# EAGLE schematic RaspFPGA (EAGLE 6.1)

## Sheet 1 of 3: FPGA
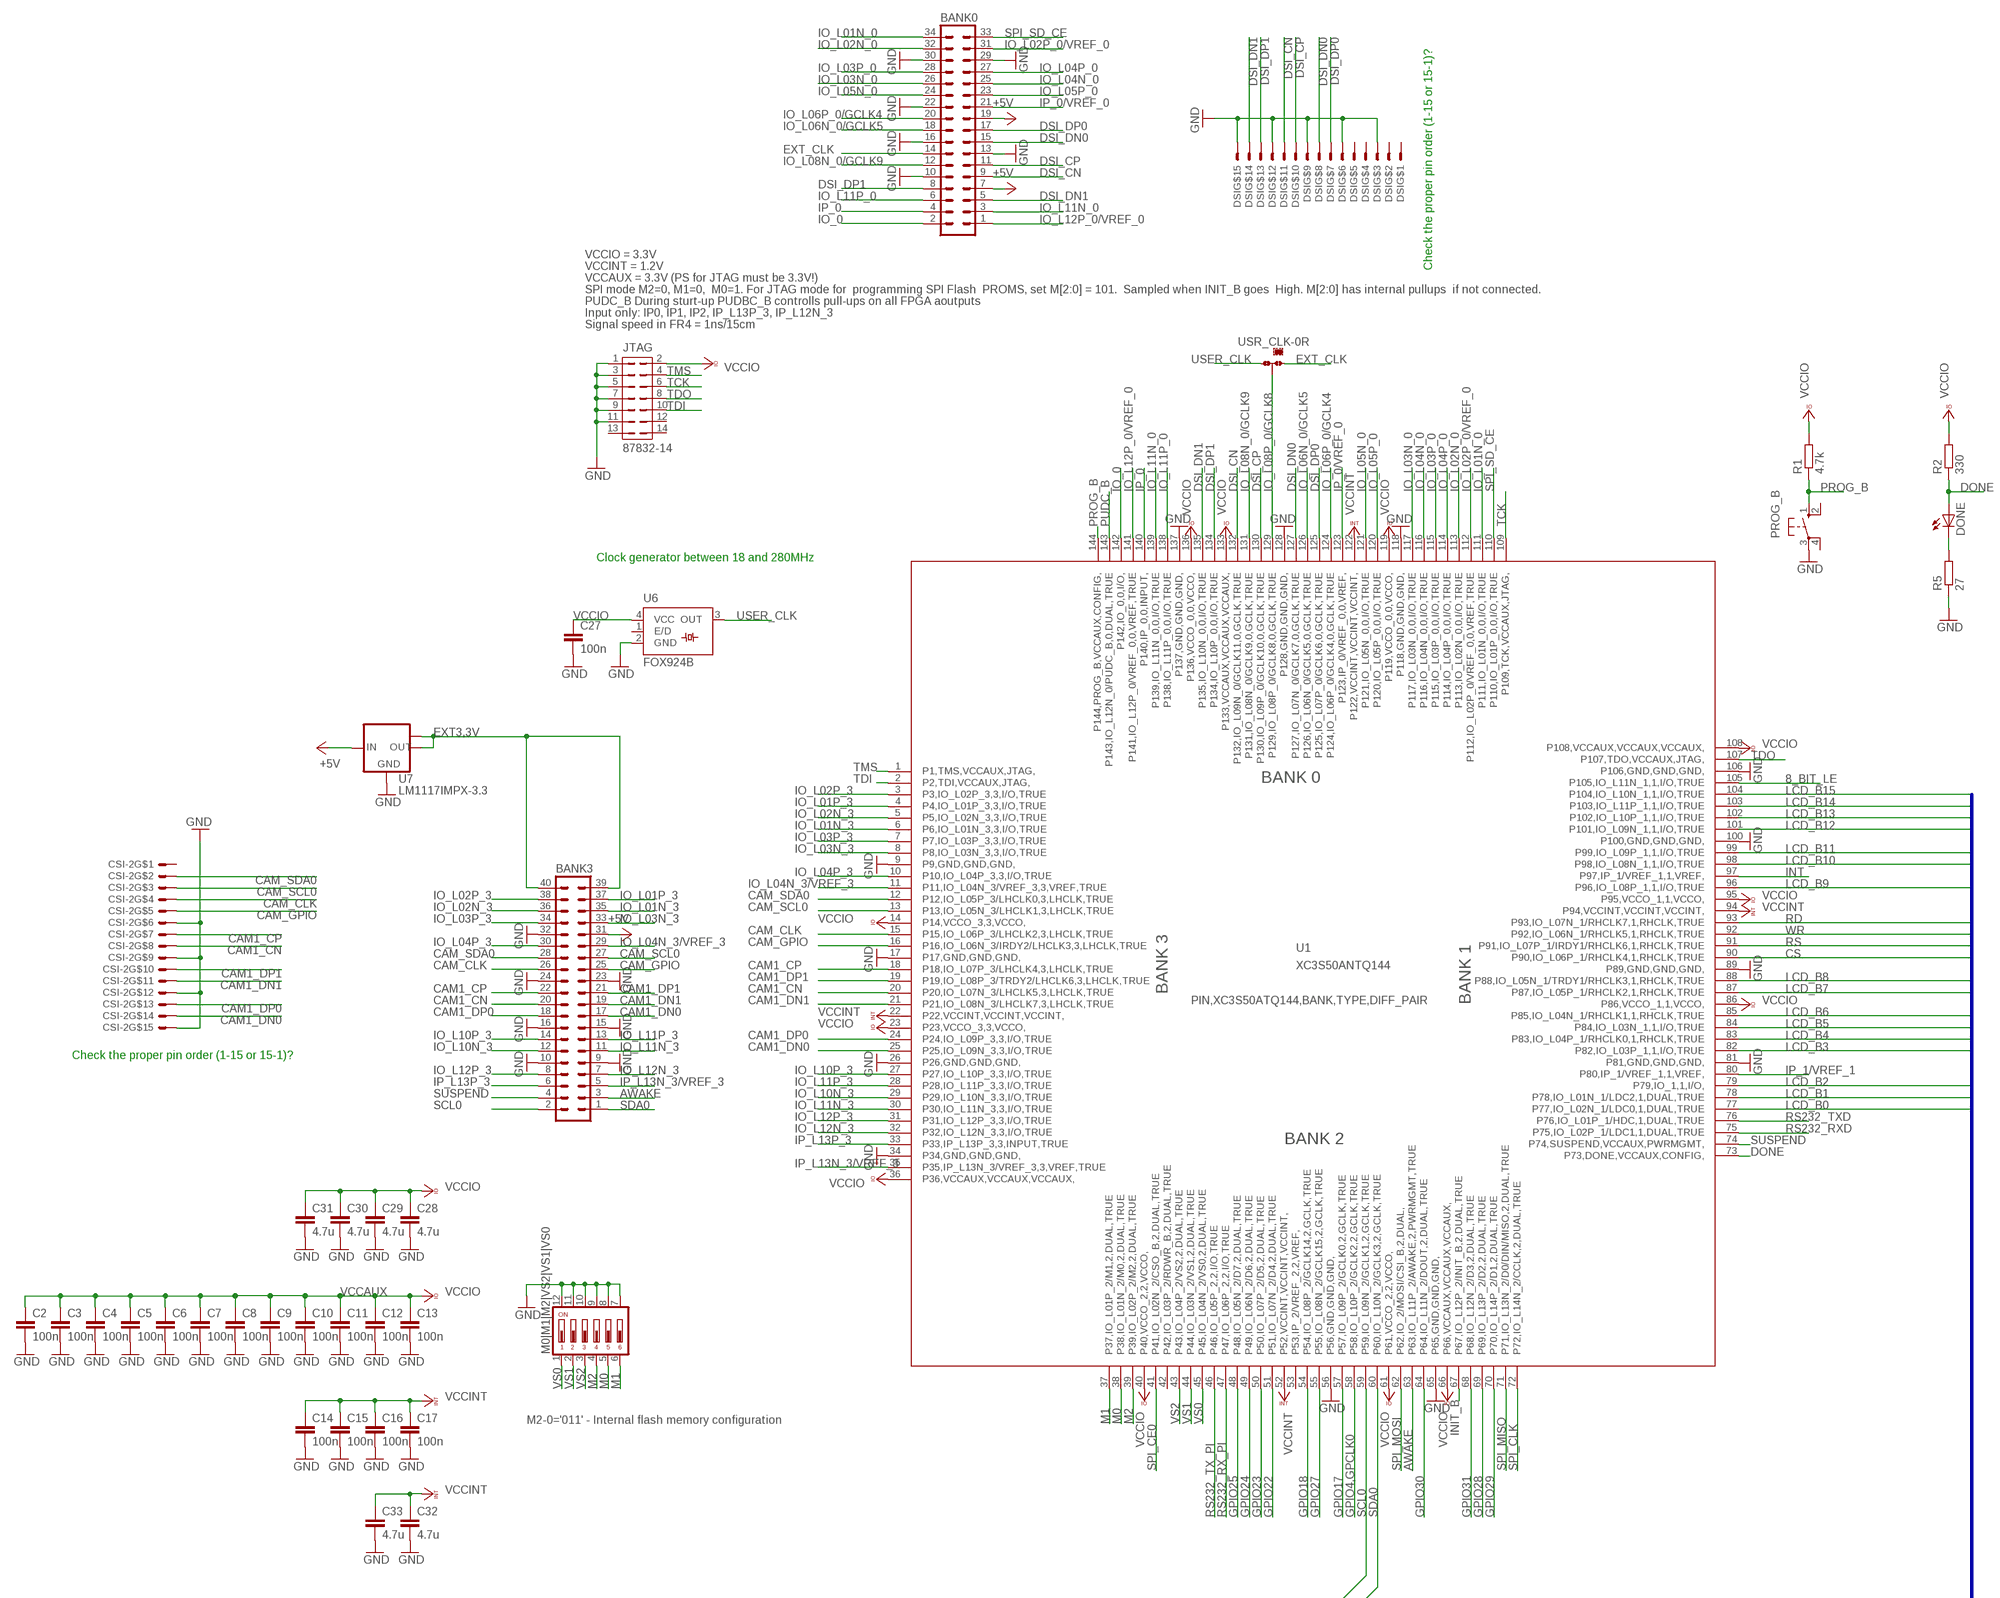
[diagram p0: schematic, sheet 1, part 1 of 3]
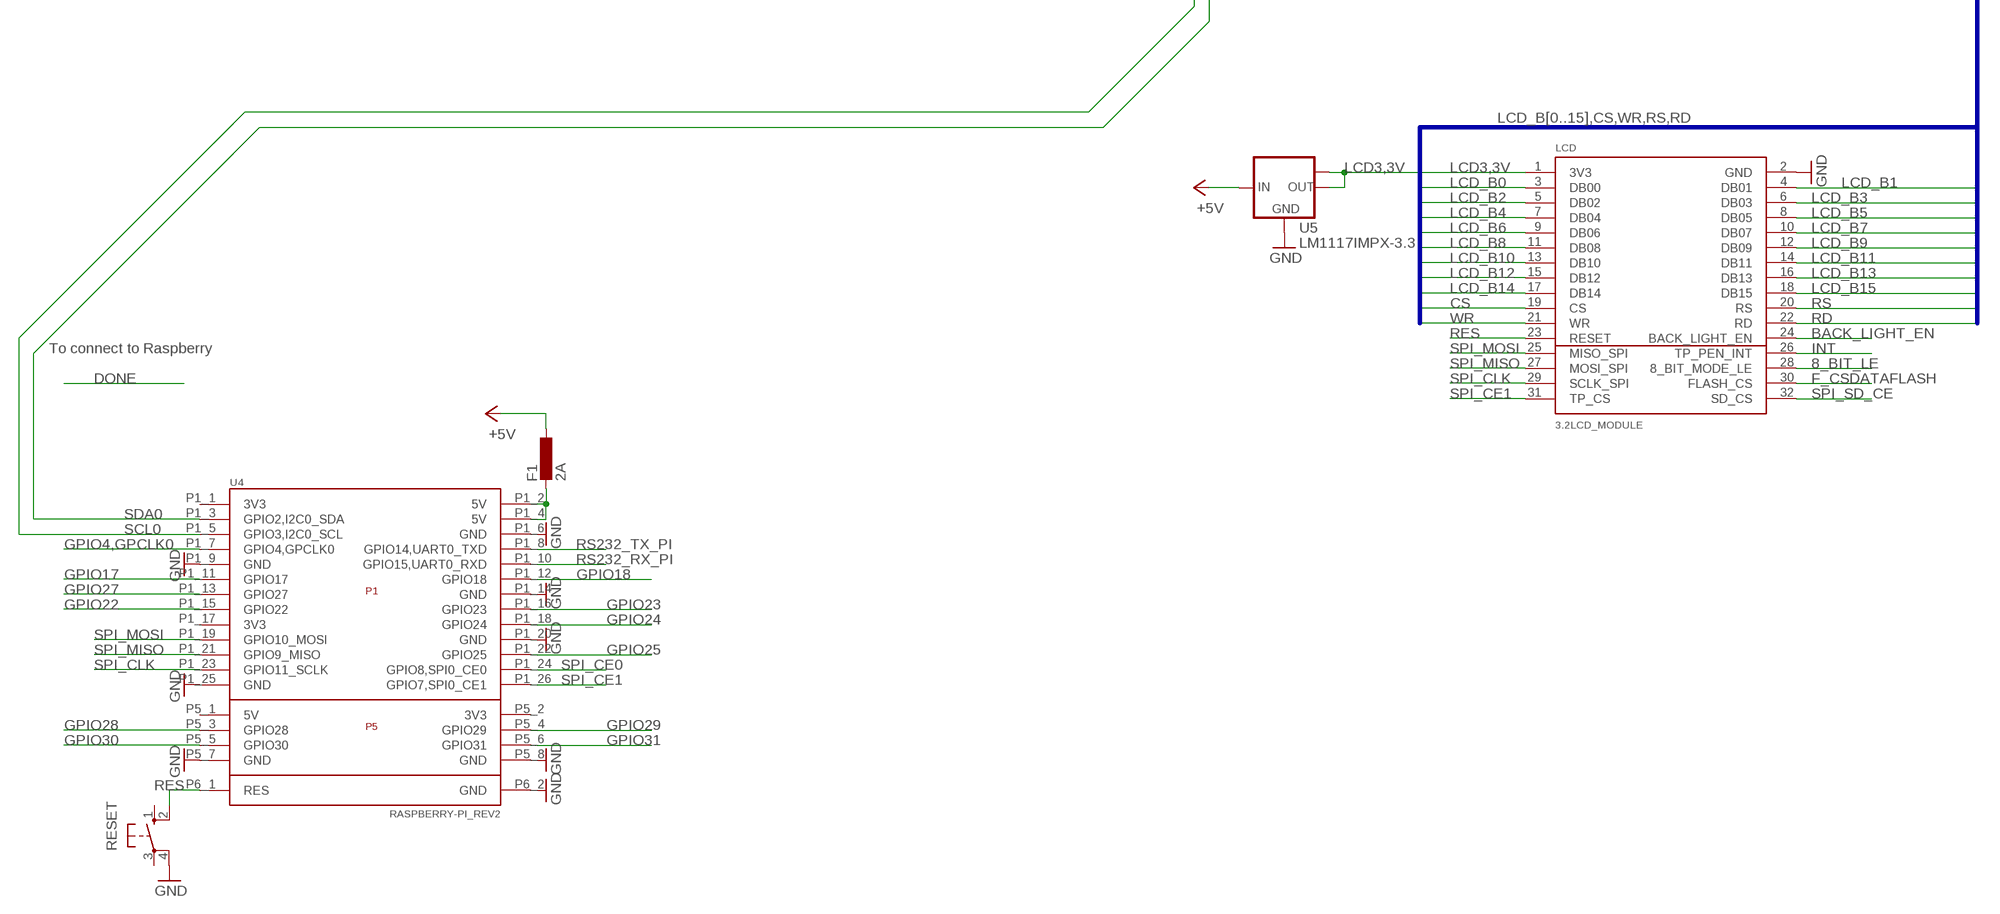
[diagram p1: schematic, sheet 1, part 2 of 3]
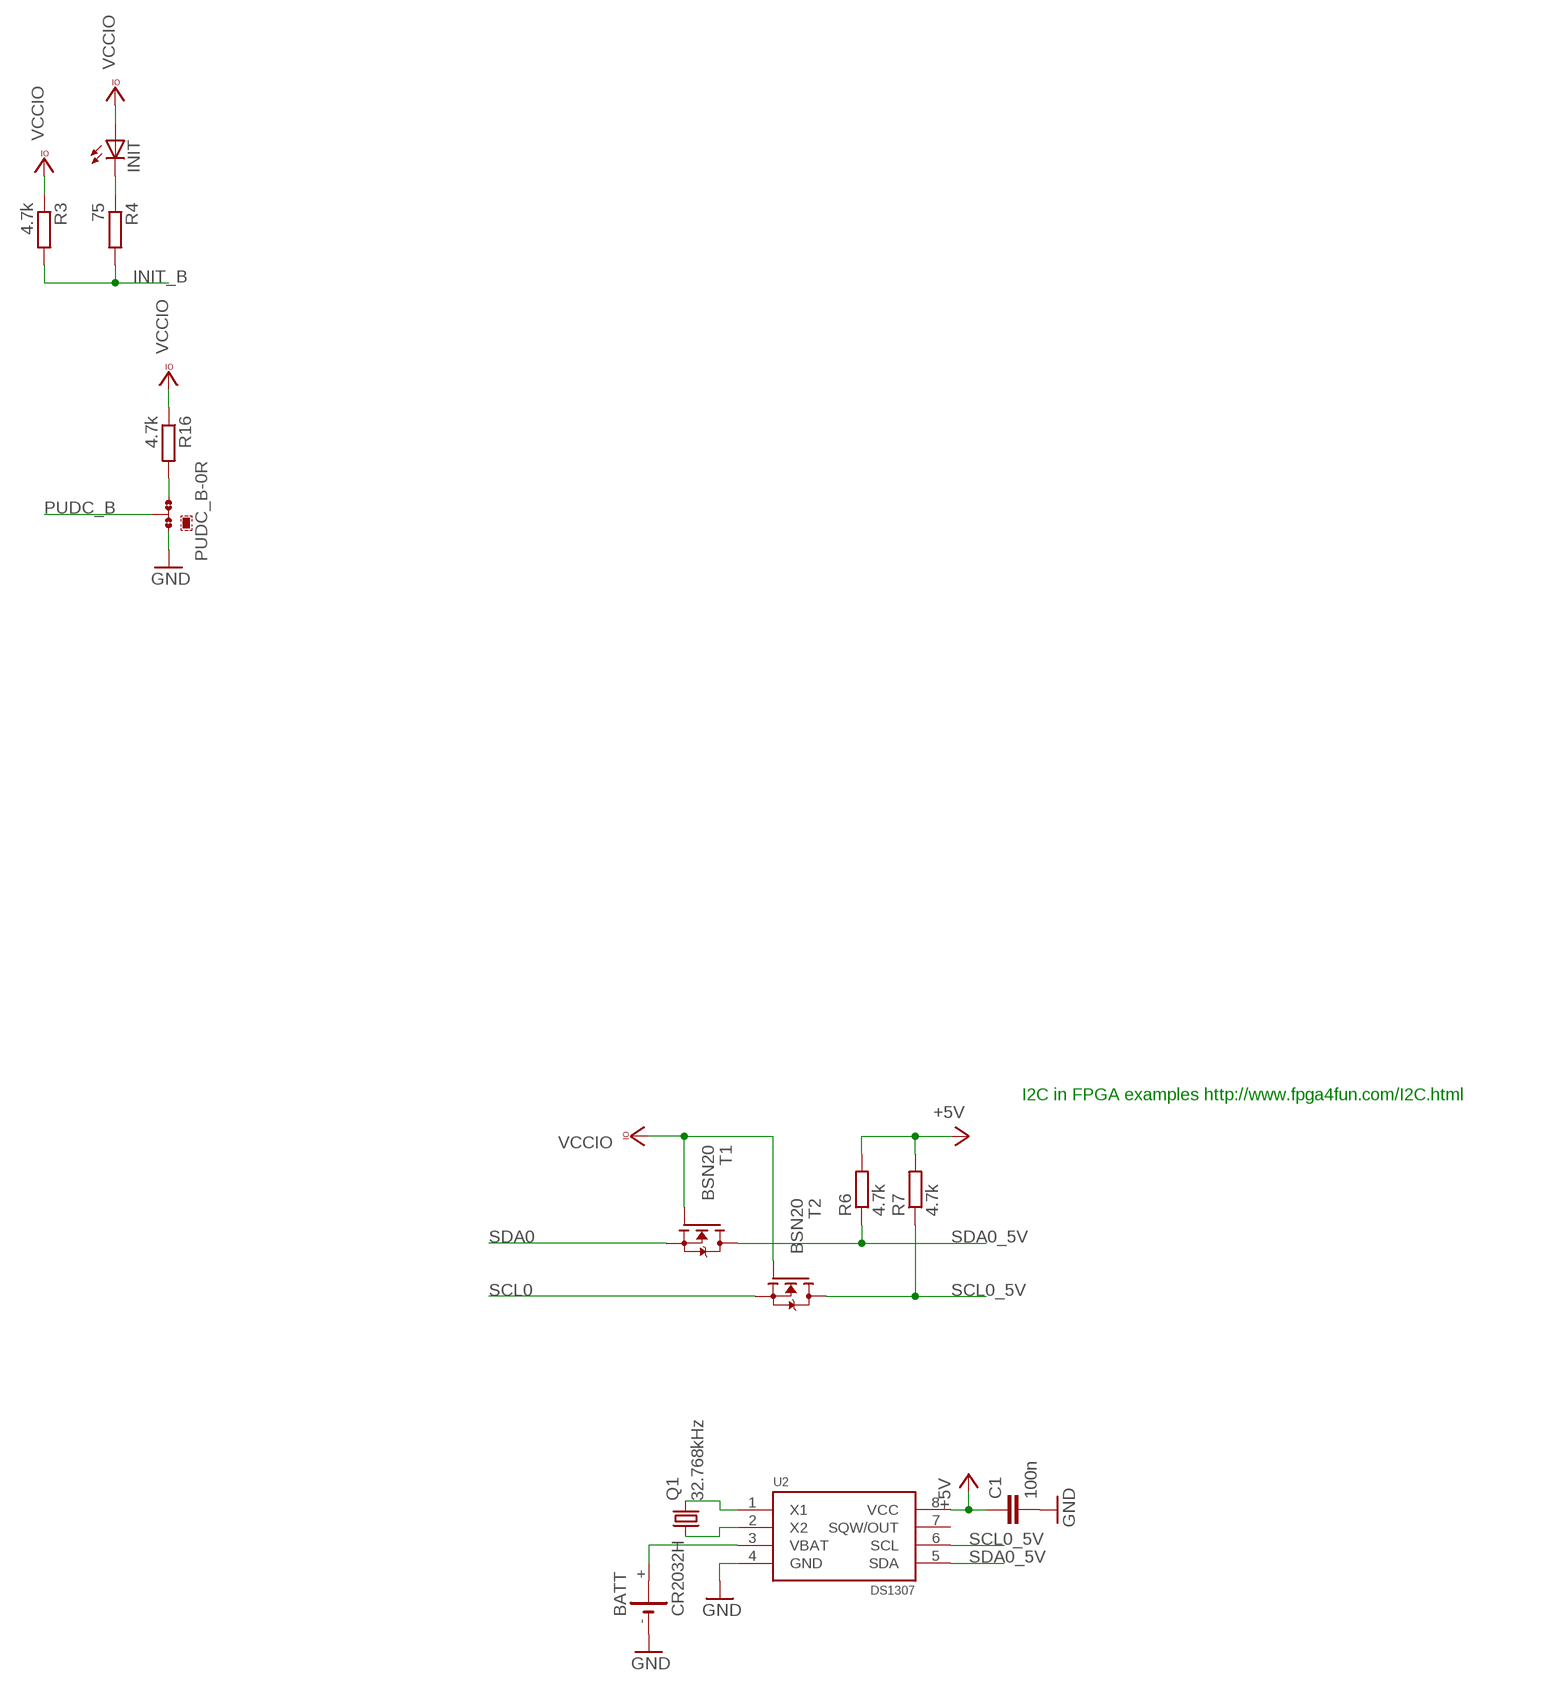
[diagram p2: schematic, sheet 1, part 3 of 3]

### Parts
BANK0  MA17-2W  [MA17-2W]
BANK3  MA20-2W  [MA20-2W]
BATT  CR2032H  [CR2032H]
C1  100n  C-EUC0603  [C0603]
C2  100n  C-EUC0603  [C0603]
C3  100n  C-EUC0603  [C0603]
C4  100n  C-EUC0603  [C0603]
C5  100n  C-EUC0603  [C0603]
C6  100n  C-EUC0603  [C0603]
C7  100n  C-EUC0603  [C0603]
C8  100n  C-EUC0603  [C0603]
C9  100n  C-EUC0603  [C0603]
C10  100n  C-EUC0603  [C0603]
C11  100n  C-EUC0603  [C0603]
C12  100n  C-EUC0603  [C0603]
C13  100n  C-EUC0603  [C0603]
C14  100n  C-EUC0603  [C0603]
C15  100n  C-EUC0603  [C0603]
C16  100n  C-EUC0603  [C0603]
C17  100n  C-EUC0603  [C0603]
C27  100n  C-EUC0603  [C0603]
C28  4.7u  C-EUC0603  [C0603]
C29  4.7u  C-EUC0603  [C0603]
C30  4.7u  C-EUC0603  [C0603]
C31  4.7u  C-EUC0603  [C0603]
C32  4.7u  C-EUC0603  [C0603]
C33  4.7u  C-EUC0603  [C0603]
CSI-2  52271-1579  [52271-1579]
DONE  LEDCHIP-LED0603  [CHIP-LED0603]
DSI  52271-1579  [52271-1579]
F1  2A  L-EUL1812  [L1812]
INIT  LEDCHIP-LED0603  [CHIP-LED0603]
JTAG  87832-14  [87832-14]
LCD  3.2LCD_MODULE  [3.2LCD_MODULE]
M0|M1|M2|VS2|VS1|VS0  DIP06YL  [DIP06YL]
PROG_B  10-XX  [B3F-10XX]
PUDC_B  0R-JUMPA  [A0R-JMP]
Q1  32.768kHz  CRYSTALTC38H  [TC38H]
R1  4.7k  R-EU_R0603  [R0603]
R2  330  R-EU_R0603  [R0603]
R3  4.7k  R-EU_R0603  [R0603]
R4  75  R-EU_R0603  [R0603]
R5  27  R-EU_R0603  [R0603]
R6  4.7k  R-EU_R0603  [R0603]
R7  4.7k  R-EU_R0603  [R0603]
R16  4.7k  R-EU_R0603  [R0603]
RESET  10-XX  [B3F-10XX]
T1  BSN20  [SOT23]
T2  BSN20  [SOT23]
U1  XC3S50ANTQ144  [TQ144]
U2  DS1307  [SO8]
U4  RASPBERRY-PI_REV2  [RASPBERRY-PI_REV2]
U5  LM1117IMPX-3.3  [SOT223]
U6  FOX924B  [FOX924B]
U7  LM1117IMPX-3.3  [SOT223]
USR_CLK  0R-JUMPA  [A0R-JMP]

### Nets
8_BIT_LE: LCD.28(8_BIT_MODE_LE) U1.105(P105,IO_L11N_1,1,I/O,TRUE)
+5V: BANK0.7 BANK0.19 BANK3.31 C1.1 F1.1 R6.2 R7.2 U2.8(VCC) U5.3(IN) U7.3(IN) ; also sheet 2
AWAKE: BANK3.3 U1.63(P63,IO_L11P_2/AWAKE,2,PWRMGMT,TRUE)
BACK_LIGHT_EN: LCD.24(BACK_LIGHT_EN)
CAM1_CN: BANK3.20 CSI-2.P$8 U1.20(P20,IO_L07N_3/LHCLK5,3,LHCLK,TRUE)
CAM1_CP: BANK3.22 CSI-2.P$7 U1.18(P18,IO_L07P_3/LHCLK4,3,LHCLK,TRUE)
CAM1_DN0: BANK3.17 CSI-2.P$14 U1.25(P25,IO_L09N_3,3,I/O,TRUE)
CAM1_DN1: BANK3.19 CSI-2.P$11 U1.21(P21,IO_L08N_3/LHCLK7,3,LHCLK,TRUE)
CAM1_DP0: BANK3.18 CSI-2.P$13 U1.24(P24,IO_L09P_3,3,I/O,TRUE)
CAM1_DP1: BANK3.21 CSI-2.P$10 U1.19(P19,IO_L08P_3/TRDY2/LHCLK6,3,LHCLK,TRUE)
CAM_CLK: BANK3.26 CSI-2.P$4 U1.15(P15,IO_L06P_3/LHCLK2,3,LHCLK,TRUE)
CAM_GPIO: BANK3.25 CSI-2.P$5 U1.16(P16,IO_L06N_3/IRDY2/LHCLK3,3,LHCLK,TRUE)
CAM_SCL0: BANK3.27 CSI-2.P$3 U1.13(P13,IO_L05N_3/LHCLK1,3,LHCLK,TRUE)
CAM_SDA0: BANK3.28 CSI-2.P$2 U1.12(P12,IO_L05P_3/LHCLK0,3,LHCLK,TRUE)
CS: LCD.19(CS) U1.90(P90,IO_L06P_1/RHCLK4,1,RHCLK,TRUE)
DONE: DONE.A R2.1 U1.73(P73,DONE,VCCAUX,CONFIG,)
DSI_CN: BANK0.9 DSI.P$11 U1.132(P132,IO_L09N_0/GCLK11,0,GCLK,TRUE)
DSI_CP: BANK0.11 DSI.P$10 U1.130(P130,IO_L09P_0/GCLK10,0,GCLK,TRUE)
DSI_DN0: BANK0.15 DSI.P$8 U1.127(P127,IO_L07N_0/GCLK7,0,GCLK,TRUE)
DSI_DN1: BANK0.5 DSI.P$14 U1.135(P135,IO_L10N_0,0,I/O,TRUE)
DSI_DP0: BANK0.17 DSI.P$7 U1.125(P125,IO_L07P_0/GCLK6,0,GCLK,TRUE)
DSI_DP1: BANK0.8 DSI.P$13 U1.134(P134,IO_L10P_0,0,I/O,TRUE)
EXT3,3V: BANK3.39 BANK3.40 U7.2(OUT) U7.TAB(OUT1)
EXT_CLK: BANK0.14 USR_CLK.1
F_CSDATAFLASH: LCD.30(FLASH_CS)
GND: BANK0.10 BANK0.13 BANK0.16 BANK0.22 BANK0.29 BANK0.30 BANK3.9 BANK3.10 BANK3.15 BANK3.16 BANK3.23 BANK3.24 BANK3.32 BATT.- C1.2 C2.2 C3.2 C4.2 C5.2 C6.2 C7.2 C8.2 C9.2 C10.2 C11.2 C12.2 C13.2 C14.2 C15.2 C16.2 C17.2 C27.2 C28.2 C29.2 C30.2 C31.2 C32.2 C33.2 CSI-2.P$6 CSI-2.P$9 CSI-2.P$12 CSI-2.P$15 DSI.P$3 DSI.P$6 DSI.P$9 DSI.P$12 DSI.P$15 JTAG.1 JTAG.3 JTAG.5 JTAG.7 JTAG.9 JTAG.11 LCD.2(GND) M0|M1|M2|VS2|VS1|VS0.7 M0|M1|M2|VS2|VS1|VS0.8 M0|M1|M2|VS2|VS1|VS0.9 M0|M1|M2|VS2|VS1|VS0.10 M0|M1|M2|VS2|VS1|VS0.11 M0|M1|M2|VS2|VS1|VS0.12 PROG_B.3(P) PUDC_B.1 R5.1 RESET.4(P1) U1.9(P9,GND,GND,GND,) U1.17(P17,GND,GND,GND,) U1.26(P26,GND,GND,GND,) U1.34(P34,GND,GND,GND,) U1.56(P56,GND,GND,GND,) U1.65(P65,GND,GND,GND,) U1.81(P81,GND,GND,GND,) U1.89(P89,GND,GND,GND,) U1.100(P100,GND,GND,GND,) U1.106(P106,GND,GND,GND,) U1.118(P118,GND,GND,GND,) U1.128(P128,GND,GND,GND,) U1.137(P137,GND,GND,GND,) U2.4(GND) U4.P1_6(GND) U4.P1_9(GND) U4.P1_14(GND) U4.P1_20(GND) U4.P1_25(GND) U4.P5_7(GND) U4.P5_8(GND) U4.P6_2(GND) U5.1(GND) U6.2(GND) U7.1(GND) ; also sheet 2,3
GPIO4,GPCLK0: U1.58(P58,IO_L10P_2/GCLK2,2,GCLK,TRUE) U4.P1_7(GPIO4,GPCLK0)
GPIO17: U1.57(P57,IO_L09P_2/GCLK0,2,GCLK,TRUE) U4.P1_11(GPIO17)
GPIO18: U1.54(P54,IO_L08P_2/GCLK14,2,GCLK,TRUE) U4.P1_12(GPIO18)
GPIO22: U1.51(P51,IO_L07N_2/D4,2,DUAL,TRUE) U4.P1_15(GPIO22)
GPIO23: U1.50(P50,IO_L07P_2/D5,2,DUAL,TRUE) U4.P1_16(GPIO23)
GPIO24: U1.49(P49,IO_L06N_2/D6,2,DUAL,TRUE) U4.P1_18(GPIO24)
GPIO25: U1.48(P48,IO_L05N_2/D7,2,DUAL,TRUE) U4.P1_22(GPIO25)
GPIO27: U1.55(P55,IO_L08N_2/GCLK15,2,GCLK,TRUE) U4.P1_13(GPIO27)
GPIO28: U1.69(P69,IO_L13P_2/D2,2,DUAL,TRUE) U4.P5_3(GPIO28)
GPIO29: U1.70(P70,IO_L14P_2/D1,2,DUAL,TRUE) U4.P5_4(GPIO29)
GPIO30: U1.64(P64,IO_L11N_2/DOUT,2,DUAL,TRUE) U4.P5_5(GPIO30)
GPIO31: U1.68(P68,IO_L12N_2/D3,2,DUAL,TRUE) U4.P5_6(GPIO31)
INIT: INIT.C R4.1
INIT_B: R3.2 R4.2 U1.67(P67,IO_L12P_2/INIT_B,2,DUAL,TRUE)
INT: LCD.26(TP_PEN_INT) U1.97(P97,IP_1/VREF_1,1,VREF,)
IO_0: BANK0.2 U1.142(P142,IO_0,0,I/O,)
IO_L01N_0: BANK0.34 U1.111(P111,IO_L01N_0,0,I/O,TRUE)
IO_L01N_3: BANK3.35 U1.6(P6,IO_L01N_3,3,I/O,TRUE)
IO_L01P_3: BANK3.37 U1.4(P4,IO_L01P_3,3,I/O,TRUE)
IO_L02N_0: BANK0.32 U1.113(P113,IO_L02N_0,0,I/O,TRUE)
IO_L02N_3: BANK3.36 U1.5(P5,IO_L02N_3,3,I/O,TRUE)
IO_L02P_0/VREF_0: BANK0.31 U1.112(P112,IO_L02P_0/VREF_0,0,VREF,TRUE)
IO_L02P_3: BANK3.38 U1.3(P3,IO_L02P_3,3,I/O,TRUE)
IO_L03N_0: BANK0.26 U1.117(P117,IO_L03N_0,0,I/O,TRUE)
IO_L03N_3: BANK3.33 U1.8(P8,IO_L03N_3,3,I/O,TRUE)
IO_L03P_0: BANK0.28 U1.115(P115,IO_L03P_0,0,I/O,TRUE)
IO_L03P_3: BANK3.34 U1.7(P7,IO_L03P_3,3,I/O,TRUE)
IO_L04N_0: BANK0.25 U1.116(P116,IO_L04N_0,0,I/O,TRUE)
IO_L04N_3/VREF_3: BANK3.29 U1.11(P11,IO_L04N_3/VREF_3,3,VREF,TRUE)
IO_L04P_0: BANK0.27 U1.114(P114,IO_L04P_0,0,I/O,TRUE)
IO_L04P_3: BANK3.30 U1.10(P10,IO_L04P_3,3,I/O,TRUE)
IO_L05N_0: BANK0.24 U1.121(P121,IO_L05N_0,0,I/O,TRUE)
IO_L05P_0: BANK0.23 U1.120(P120,IO_L05P_0,0,I/O,TRUE)
IO_L06N_0/GCLK5: BANK0.18 U1.126(P126,IO_L06N_0/GCLK5,0,GCLK,TRUE)
IO_L06P_0/GCLK4: BANK0.20 U1.124(P124,IO_L06P_0/GCLK4,0,GCLK,TRUE)
IO_L08N_0/GCLK9: BANK0.12 U1.131(P131,IO_L08N_0/GCLK9,0,GCLK,TRUE)
IO_L08P_0/GCLK8: U1.129(P129,IO_L08P_0/GCLK8,0,GCLK,TRUE) USR_CLK.2
IO_L10N_3: BANK3.12 U1.29(P29,IO_L10N_3,3,I/O,TRUE)
IO_L10P_3: BANK3.14 U1.27(P27,IO_L10P_3,3,I/O,TRUE)
IO_L11N_0: BANK0.3 U1.139(P139,IO_L11N_0,0,I/O,TRUE)
IO_L11N_3: BANK3.11 U1.30(P30,IO_L11N_3,3,I/O,TRUE)
IO_L11P_0: BANK0.6 U1.138(P138,IO_L11P_0,0,I/O,TRUE)
IO_L11P_3: BANK3.13 U1.28(P28,IO_L11P_3,3,I/O,TRUE)
IO_L12N_3: BANK3.7 U1.32(P32,IO_L12N_3,3,I/O,TRUE)
IO_L12P_0/VREF_0: BANK0.1 U1.141(P141,IO_L12P_0/VREF_0,0,VREF,TRUE)
IO_L12P_3: BANK3.8 U1.31(P31,IO_L12P_3,3,I/O,TRUE)
IP_0: BANK0.4 U1.140(P140,IP_0,0,INPUT,)
IP_0/VREF_0: BANK0.21 U1.123(P123,IP_0/VREF_0,0,VREF,)
IP_1/VREF_1: U1.80(P80,IP_1/VREF_1,1,VREF,)
IP_L13N_3/VREF_3: BANK3.5 U1.35(P35,IP_L13N_3/VREF_3,3,VREF,TRUE)
IP_L13P_3: BANK3.6 U1.33(P33,IP_L13P_3,3,INPUT,TRUE)
LCD3,3V: LCD.1(3V3) U5.2(OUT) U5.TAB(OUT1)
LCD_B0: LCD.3(DB00) U1.77(P77,IO_L02N_1/LDC0,1,DUAL,TRUE)
LCD_B1: LCD.4(DB01) U1.78(P78,IO_L01N_1/LDC2,1,DUAL,TRUE)
LCD_B2: LCD.5(DB02) U1.79(P79,IO_1,1,I/O,)
LCD_B3: LCD.6(DB03) U1.82(P82,IO_L03P_1,1,I/O,TRUE)
LCD_B4: LCD.7(DB04) U1.83(P83,IO_L04P_1/RHCLK0,1,RHCLK,TRUE)
LCD_B5: LCD.8(DB05) U1.84(P84,IO_L03N_1,1,I/O,TRUE)
LCD_B6: LCD.9(DB06) U1.85(P85,IO_L04N_1/RHCLK1,1,RHCLK,TRUE)
LCD_B7: LCD.10(DB07) U1.87(P87,IO_L05P_1/RHCLK2,1,RHCLK,TRUE)
LCD_B8: LCD.11(DB08) U1.88(P88,IO_L05N_1/TRDY1/RHCLK3,1,RHCLK,TRUE)
LCD_B9: LCD.12(DB09) U1.96(P96,IO_L08P_1,1,I/O,TRUE)
LCD_B10: LCD.13(DB10) U1.98(P98,IO_L08N_1,1,I/O,TRUE)
LCD_B11: LCD.14(DB11) U1.99(P99,IO_L09P_1,1,I/O,TRUE)
LCD_B12: LCD.15(DB12) U1.101(P101,IO_L09N_1,1,I/O,TRUE)
LCD_B13: LCD.16(DB13) U1.102(P102,IO_L10P_1,1,I/O,TRUE)
LCD_B14: LCD.17(DB14) U1.103(P103,IO_L11P_1,1,I/O,TRUE)
LCD_B15: LCD.18(DB15) U1.104(P104,IO_L10N_1,1,I/O,TRUE)
M0: M0|M1|M2|VS2|VS1|VS0.5 U1.38(P38,IO_L01N_2/M0,2,DUAL,TRUE)
M1: M0|M1|M2|VS2|VS1|VS0.6 U1.37(P37,IO_L01P_2/M1,2,DUAL,TRUE)
M2: M0|M1|M2|VS2|VS1|VS0.4 U1.39(P39,IO_L02P_2/M2,2,DUAL,TRUE)
N$1: F1.2 U4.P1_2(5V) U4.P1_4(5V)
N$2: DONE.C R5.2
N$6: PUDC_B.3 R16.2
N$23: Q1.1 U2.2(X2)
N$24: Q1.2 U2.1(X1)
N$35: BATT.+ U2.3(VBAT)
PROG_B: PROG_B.1(S) R1.1 U1.144(P144,PROG_B,VCCAUX,CONFIG,)
PUDC_B: PUDC_B.2 U1.143(P143,IO_L12N_0/PUDC_B,0,DUAL,TRUE)
RD: LCD.22(RD) U1.93(P93,IO_L07N_1/RHCLK7,1,RHCLK,TRUE)
RES: LCD.23(RESET) RESET.2(S1) U4.P6_1(RES)
RS: LCD.20(RS) U1.91(P91,IO_L07P_1/IRDY1/RHCLK6,1,RHCLK,TRUE)
RS232_RX_PI: U1.47(P47,IO_L06P_2,2,I/O,TRUE) U4.P1_10(GPIO15,UART0_RXD)
RS232_RXD: U1.75(P75,IO_L02P_1/LDC1,1,DUAL,TRUE) ; also sheet 3
RS232_TX_PI: U1.46(P46,IO_L05P_2,2,I/O,TRUE) U4.P1_8(GPIO14,UART0_TXD)
RS232_TXD: U1.76(P76,IO_L01P_1/HDC,1,DUAL,TRUE) ; also sheet 3
SCL0: BANK3.2 T2.2(S) U1.59(P59,IO_L09N_2/GCLK1,2,GCLK,TRUE) U4.P1_5(GPIO3,I2C0_SCL)
SCL0_5V: R7.1 T2.3(D) U2.6(SCL)
SDA0: BANK3.1 T1.2(S) U1.60(P60,IO_L10N_2/GCLK3,2,GCLK,TRUE) U4.P1_3(GPIO2,I2C0_SDA)
SDA0_5V: R6.1 T1.3(D) U2.5(SDA)
SPI_CE0: U1.41(P41,IO_L02N_2/CSO_B,2,DUAL,TRUE) U4.P1_24(GPIO8,SPI0_CE0)
SPI_CE1: LCD.31(TP_CS) U4.P1_26(GPIO7,SPI0_CE1)
SPI_CLK: LCD.29(SCLK_SPI) U1.72(P72,IO_L14N_2/CCLK,2,DUAL,TRUE) U4.P1_23(GPIO11_SCLK)
SPI_MISO: LCD.27(MOSI_SPI) U1.71(P71,IO_L13N_2/D0/DIN/MISO,2,DUAL,TRUE) U4.P1_21(GPIO9_MISO)
SPI_MOSI: LCD.25(MISO_SPI) U1.62(P62,IO_2/MOSI/CSI_B,2,DUAL,) U4.P1_19(GPIO10_MOSI)
SPI_SD_CE: BANK0.33 LCD.32(SD_CS) U1.110(P110,IO_L01P_0,0,I/O,TRUE)
SUSPEND: BANK3.4 U1.74(P74,SUSPEND,VCCAUX,PWRMGMT,)
TCK: JTAG.6 U1.109(P109,TCK,VCCAUX,JTAG,)
TDI: JTAG.10 U1.2(P2,TDI,VCCAUX,JTAG,)
TDO: JTAG.8 U1.107(P107,TDO,VCCAUX,JTAG,)
TMS: JTAG.4 U1.1(P1,TMS,VCCAUX,JTAG,)
USER_CLK: U6.3(OUT) USR_CLK.3
VCCINT: C14.1 C15.1 C16.1 C17.1 C32.1 C33.1 U1.22(P22,VCCINT,VCCINT,VCCINT,) U1.52(P52,VCCINT,VCCINT,VCCINT,) U1.94(P94,VCCINT,VCCINT,VCCINT,) U1.122(P122,VCCINT,VCCINT,VCCINT,) ; also sheet 2
VCCIO: C2.1 C3.1 C4.1 C5.1 C6.1 C7.1 C8.1 C9.1 C10.1 C11.1 C12.1 C13.1 C27.1 C28.1 C29.1 C30.1 C31.1 INIT.A JTAG.2 R1.2 R2.2 R3.1 R16.1 T1.1(G) T2.1(G) U1.14(P14,VCCO_3,3,VCCO,) U1.23(P23,VCCO_3,3,VCCO,) U1.36(P36,VCCAUX,VCCAUX,VCCAUX,) U1.40(P40,VCCO_2,2,VCCO,) U1.61(P61,VCCO_2,2,VCCO,) U1.66(P66,VCCAUX,VCCAUX,VCCAUX,) U1.86(P86,VCCO_1,1,VCCO,) U1.95(P95,VCCO_1,1,VCCO,) U1.108(P108,VCCAUX,VCCAUX,VCCAUX,) U1.119(P119,VCCO_0,0,VCCO,) U1.133(P133,VCCAUX,VCCAUX,VCCAUX,) U1.136(P136,VCCO_0,0,VCCO,) U6.4(VCC) ; also sheet 2
VS0: M0|M1|M2|VS2|VS1|VS0.1 U1.45(P45,IO_L04N_2/VS0,2,DUAL,TRUE)
VS1: M0|M1|M2|VS2|VS1|VS0.2 U1.44(P44,IO_L03N_2/VS1,2,DUAL,TRUE)
VS2: M0|M1|M2|VS2|VS1|VS0.3 U1.43(P43,IO_L04P_2/VS2,2,DUAL,TRUE)
WR: LCD.21(WR) U1.92(P92,IO_L06N_1/RHCLK5,1,RHCLK,TRUE)
Unconnected: BATT.+@1(+) CSI-2.P$1 DSI.P$1 DSI.P$2 DSI.P$4 DSI.P$5 JTAG.12 JTAG.13 JTAG.14 PROG_B.2(S1) PROG_B.4(P1) RESET.1(S) RESET.3(P) U1.42(P42,IO_L03P_2/RDWR_B,2,DUAL,TRUE) U1.53(P53,IP_2/VREF_2,2,VREF,) U2.7(SQW/OUT) U4.P1_1(3V3) U4.P1_17(3V3) U4.P5_1(5V) U4.P5_2(3V3) U6.1(E/D)

### Buses
LCD_B[0..15],CS,WR,RS,RD

### Notes on the sheet
- Check the proper pin order (1-15 or 15-1)?
- VCCIO = 3.3V
- VCCINT = 1.2V
- VCCAUX = 3.3V (PS for JTAG must be 3.3V!)
- SPI mode M2=0, M1=0,  M0=1. For JTAG mode for  programming SPI Flash  PROMS, set M[2:0] = 101.  Sampled when INIT_B goes  High. M[2:0] has internal pullups  if not connected.
- PUDC_B During sturt-up PUDBC_B controlls pull-ups on all FPGA aoutputs
- Input only: IP0, IP1, IP2, IP_L13P_3, IP_L12N_3
- Signal speed in FR4 = 1ns/15cm
- Clock generator between 18 and 280MHz
- PIN,XC3S50ATQ144,BANK,TYPE,DIFF_PAIR
- I2C in FPGA examples http://www.fpga4fun.com/I2C.html
- Check the proper pin order (1-15 or 15-1)?
- VCCAUX
- M2-0='011' - Internal flash memory configuration
- To connect to Raspberry

## Sheet 2 of 3: Power supply
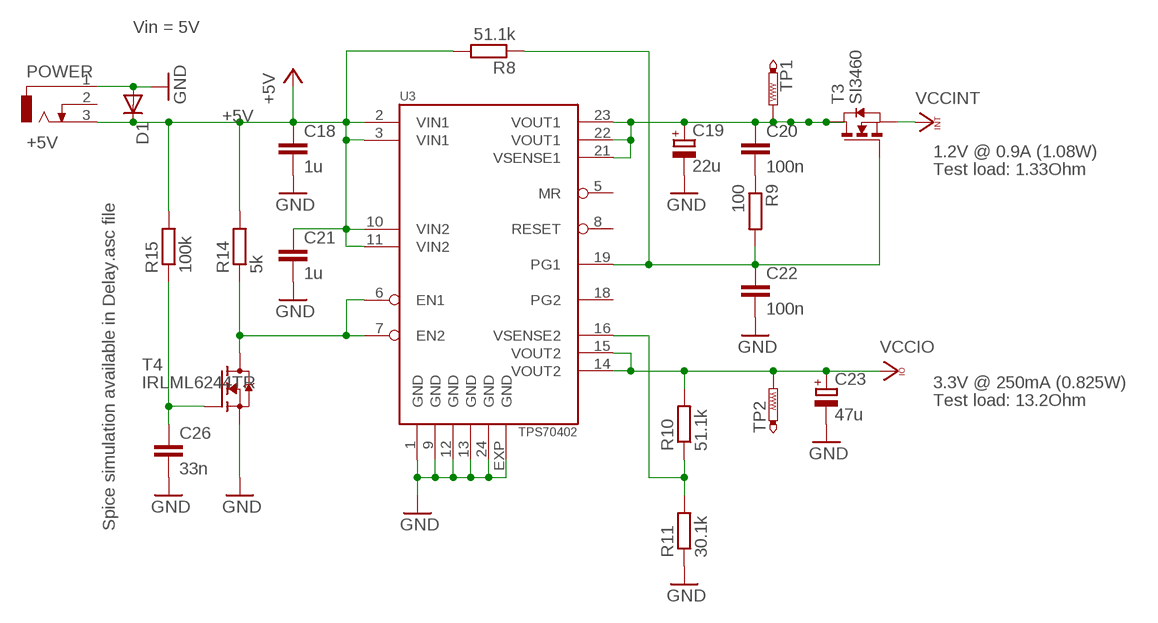
[diagram p3: schematic, sheet 2]

### Parts
C18  1u  C-EUC1206  [C1206]
C19  22u  CPOL-EUF  [PANASONIC_F]
C20  100n  C-EUC0603  [C0603]
C21  1u  C-EUC1206  [C1206]
C22  100n  C-EUC0603  [C0603]
C23  47u  CPOL-EUF  [PANASONIC_F]
C26  33n  C-EUC0603  [C0603]
D1  DIODE-DO-214AC  [DO-214AC]
POWER  +5V  DCJ0202  [DCJ0202]
R8  51.1k  R-EU_R0603  [R0603]
R9  100  R-EU_R0603  [R0603]
R10  51.1k  R-EU_R0603  [R0603]
R11  30.1k  R-EU_R0603  [R0603]
R14  5k  R-EU_R0603  [R0603]
R15  100k  R-EU_R0603  [R0603]
T3  SI3460  [SOT23-6]
T4  IRLML6244TR  [SOT23]
TP1  PTR1B1,27  [B1,27]
TP2  PTR1B1,27  [B1,27]
U3  TPS70402  [HTSSOP24PWP]

### Nets
+5V: C18.1 C21.1 D1.C POWER.3 R8.2 R14.2 R15.2 U3.2(VIN1) U3.3(VIN1) U3.10(VIN2) U3.11(VIN2) ; also sheet 1
GND: C18.2 C19.- C21.2 C22.2 C23.- C26.2 D1.A POWER.1 R11.1 T4.2(S) U3.1(GND) U3.9(GND) U3.12(GND) U3.13(GND) U3.24(GND) U3.EXP(GND) ; also sheet 1,3
N$3: R14.1 T4.3(D) U3.6(EN1) U3.7(EN2)
N$5: C26.1 R15.1 T4.1(G)
N$29: C22.1 R8.1 R9.2 T3.3(G) U3.19(PG1)
N$30: R10.1 R11.2 U3.16(VSENSE2)
N$36: C20.2 R9.1
T1: C19.+ C20.1 T3.1(D1) T3.2(D2) T3.5(D3) T3.6(D) TP1.PP(TP) U3.21(VSENSE1) U3.22(VOUT1) U3.23(VOUT1)
VCCINT: T3.4(S) ; also sheet 1
VCCIO: C23.+ R10.2 TP2.PP(TP) U3.14(VOUT2) U3.15(VOUT2) ; also sheet 1
Unconnected: POWER.2 U3.5(MR) U3.8(RESET) U3.18(PG2)

### Notes on the sheet
- Vin = 5V
- 1.2V @ 0.9A (1.08W)
- Test load: 1.33Ohm
- 3.3V @ 250mA (0.825W)
- Test load: 13.2Ohm
- Spice simulation available in Delay.asc file

## Sheet 3 of 3: USB-RS232
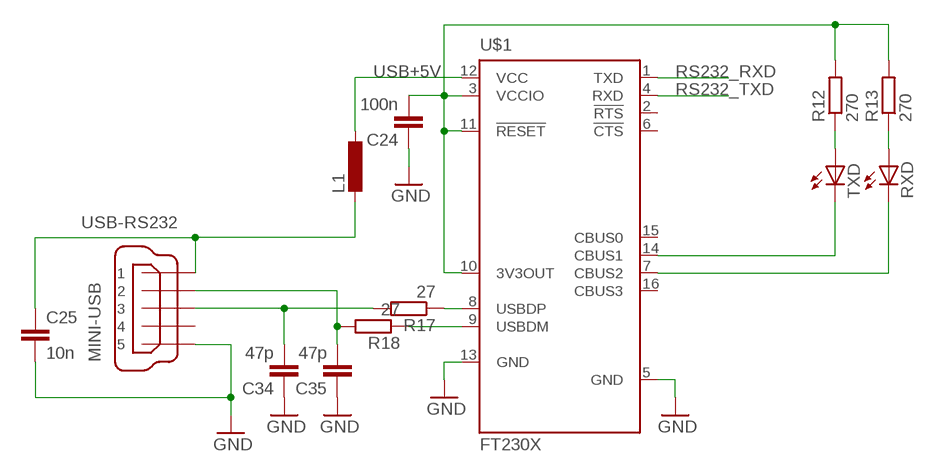
[diagram p4: schematic, sheet 3]

### Parts
C24  100n  C-EUC0603  [C0603]
C25  10n  C-EUC0603  [C0603]
C34  47p  C-EUC0603  [C0603]
C35  47p  C-EUC0603  [C0603]
L1  L-EUL2012C  [L2012C]
R12  270  R-EU_R0603  [R0603]
R13  270  R-EU_R0603  [R0603]
R17  27  R-EU_R0603  [R0603]
R18  27  R-EU_R0603  [R0603]
RXD  LEDCHIP-LED0805  [CHIP-LED0805]
TXD  LEDCHIP-LED0805  [CHIP-LED0805]
U$1  FT230X  [SSOP16]
USB-RS232  MINI-USB  MINI-USB-32005-201  [32005-201]

### Nets
FT232_VCCIO: C24.2 R12.2 R13.2 U$1.3(VCCIO) U$1.10(3V3OUT) U$1.11(!RESET)
GND: C24.1 C25.2 C34.1 C35.1 U$1.5(GND) U$1.13(GND) USB-RS232.5 ; also sheet 1,2
N$4: C25.1 L1.2 USB-RS232.1
N$44: R12.1 TXD.A
N$46: R13.1 RXD.A
N$47: TXD.C U$1.14(CBUS1)
N$48: RXD.C U$1.7(CBUS2)
RS232_RXD: U$1.1(TXD) ; also sheet 1
RS232_TXD: U$1.4(RXD) ; also sheet 1
USB+5V: L1.1 U$1.12(VCC)
USBDM: C35.2 R18.2 USB-RS232.2
USBDMF: R18.1 U$1.9(USBDM)
USBDP: C34.2 R17.2 USB-RS232.3
USBDPF: R17.1 U$1.8(USBDP)
Unconnected: U$1.2(!RTS) U$1.6(!CTS) U$1.15(CBUS0) U$1.16(CBUS3) USB-RS232.4

## Library data of the parts
BANK0 = con-lstb:MA17-2W: PIN HEADER
BANK3 = con-lstb:MA20-2W: PIN HEADER; OC_FARNELL: unknown; OC_NEWARK: unknown
BATT = battery:CR2032H: LI BATTERY Varta
C1-C18 C20-C22 C24-C35 = rcl:C-EU: CAPACITOR, European symbol
C19 C23 = rcl:CPOL-EU: POLARIZED CAPACITOR, European symbol
CSI-2 DSI = con-molex-mod:52271-1579
D1 = diode:DIODE-: DIODE
DONE INIT RXD TXD = led:LED: LED OSRAM: - CHIPLED LG R971, LG N971, LY N971, LG Q971, LY Q971, LO R971, LY R971 LH N974, LH R974 LS Q976, LO Q976, LY Q976 LO Q996 - Hyper CHIPLED LW Q18S LB Q993, LB Q99A, LB R99A - SideLED LS A670, LO A670, LY A670, LG A670, LP A670 LB A673, LV A673, LT A673, LW A673 LH A674 LY A675 LS A676, LA A676, LO A676, LY A676, LW A676 LS A679, LY A679, LG A679 - Hyper Micro SIDELED® LS Y876, LA Y876, LO Y876, LY Y876 LT Y87S - SmartLED LW L88C, LW L88S LB L89C, LB L89S, LG L890 LS L89K, LO L89K, LY L89K LS L896, LA L896, LO L896, LY L896 - TOPLED LS T670, LO T670, LY T670, LG T670, LP T670 LSG T670, LSP T670, LSY T670, LOP T670, LYG T670 LG T671, LOG T671, LSG T671 LB T673, LV T673, LT T673, LW T673 LH T674 LS T676, LA T676, LO T676, LY T676, LB T676, LH T676, LSB T676, LW T676 LB T67C, LV T67C, LT T67C, LS T67K, LO T67K, LY T67K, LW E67C LS E67B, LA E67B, LO E67B, LY E67B, LB E67C, LV E67C, LT E67C LW T67C LS T679, LY T679, LG T679 LS T770, LO T770, LY T770, LG T770, LP T770 LB T773, LV T773, LT T773, LW T773 LH T774 LS E675, LA E675, LY E675, LS T675 LS T776, LA T776, LO T776, LY T776, LB T776 LHGB T686 LT T68C, LB T68C - Hyper Mini TOPLED® LB M676 - Mini TOPLED Santana® LG M470 LS M47K, LO M47K, LY M47K Source: http://www.osram.convergy.de LUXEON: - LUMILED® LXK2-PW12-R00, LXK2-PW12-S00, LXK2-PW14-U00, LXK2-PW14-V00 LXK2-PM12-R00, LXK2-PM12-S00, LXK2-PM14-U00 LXK2-PE12-Q00, LXK2-PE12-R00, LXK2-PE12-S00, LXK2-PE14-T00, LXK2-PE14-U00 LXK2-PB12-K00, LXK2-PB12-L00, LXK2-PB12-M00, LXK2-PB14-N00, LXK2-PB14-P00, LXK2-PB14-Q00 LXK2-PR12-L00, LXK2-PR12-M00, LXK2-PR14-Q00, LXK2-PR14-R00 LXK2-PD12-Q00, LXK2-PD12-R00, LXK2-PD12-S00 LXK2-PH12-R00, LXK2-PH12-S00 LXK2-PL12-P00, LXK2-PL12-Q00, LXK2-PL12-R00 Source: www.luxeon.com KINGBRIGHT: KA-3528ASYC Source: www.kingbright.com
F1 L1 = rcl:L-EU: INDUCTOR, European symbol
JTAG = con-molex:87832-14: Milli-Grid Header 2.00mm (.079") Pitch
LCD = 3.2inch LCD TFT:3.2LCD_MODULE
M0|M1|M2|VS2|VS1|VS0 = switch-dil:DIP06YL: DIL/CODE SWITCH; OC_FARNELL: unknown; OC_NEWARK: unknown
POWER = con-jack:DCJ0202: DC POWER JACK Source: DCJ0202.pdf
PROG_B RESET = switch-omron:10-XX: OMRON SWITCH
PUDC_B USR_CLK = jump-0r-smd:0R-JUMP: SMD 0R 0805 Jumper
Q1 = crystal:CRYSTAL: CRYSTAL
R1-R18 = rcl:R-EU_: RESISTOR, European symbol
T1 T2 = transistor-fet_mod:BSN20
T3 = Si3460 transistor:SI3460
T4 = transistor-fet_mod:IRLML6244TR
TP1 TP2 = testpad:PTR1: TEST PIN
U1 = Spartan3 XC3S50AN:XC3S50ANTQ144
U2 = DS1307 RTC I2C:DS1307
U3 = texas-mod:TPS70402
U4 = RaspberryPi:RASPBERRY-PI_REV2: Raspberry Pi Board <http://www.raspberrypi.org/> Jacques Lagnel V1.0 (beta) 2012 Mateusz Bawaj V1.1 (beta) 2012 Board dimension: Forum 3D model <http://www.raspberrypi.org/forum/general-discussion/mechanical-profile-3d-models?value=3d%20model&type=1&include=1&search=1&ret=all> The GPIO Connector (P1): http://elinux.org/RPi_Low-level_peripherals The GPIO Connector (P5): http://www.raspberrypi-spy.co.uk/2012/09/raspberry-pi-p5-header/
U5 U7 = lm1117:LM1117IMPX-*
U6 = crystal-mod:FOX924B
U$1 = ftdichip-mod:FT230X
USB-RS232 = con-cypressindustries:MINI-USB-: MINI USB-B Conector Source: www.cypressindustries.com